# Altium project LimePSB-RPCM_1v2.PrjPcb (part 13 of 13)
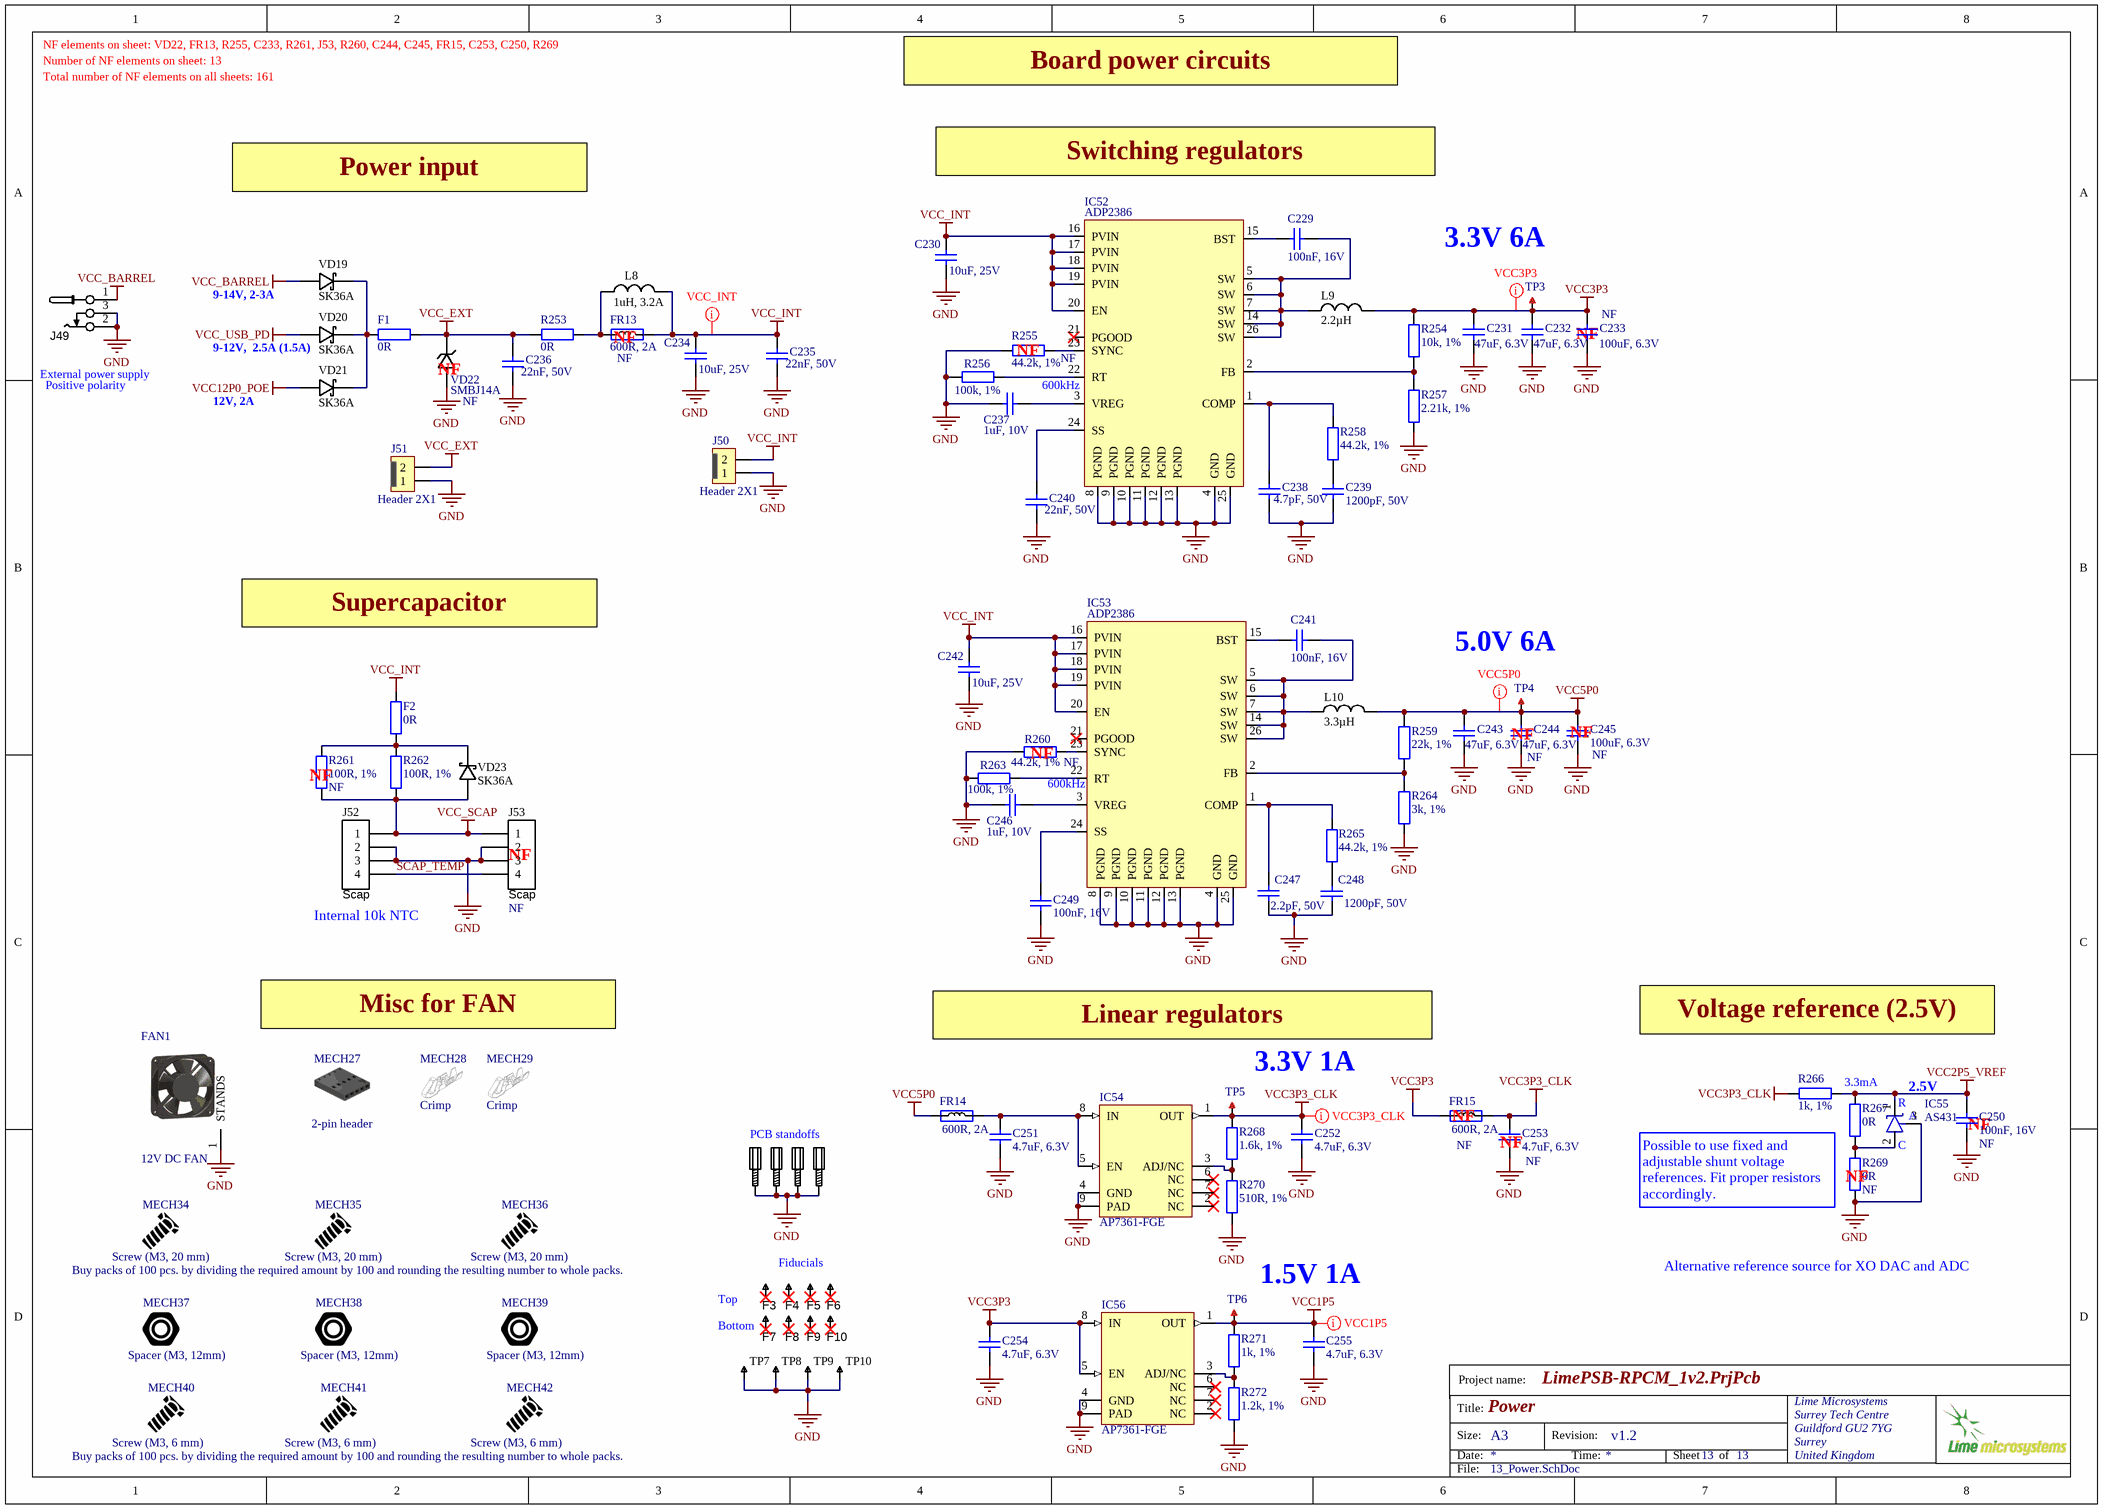
[diagram p113: 13_Power.SchDoc]

## Nets that join several sheets
GND: 05_RPi_mPCIe (82 pins), 06_Misc_1 (74 pins), 07_Misc_2 (72 pins), 08_USB_hub (61 pins), 09_USB_HDMI (90 pins), 10_Clock (80 pins), 11_RFFE (142 pins), 12_PoE_USB_PD (31 pins), 13_Power (73 pins)
USB_VBUS_IN: 08_USB_hub (6 pins), 12_PoE_USB_PD (7 pins)
VCC1P5: 05_RPi_mPCIe (J3.6 J3.28 J3.48), 13_Power (C255.2 IC56.1 R271.2 TP6.1)
VCC2P5_VREF: 07_Misc_2 (R48.1), 10_Clock (R165.2), 13_Power (C250.2 IC55.1 R266.1 R267.1)
VCC3P3: 05_RPi_mPCIe (9 pins), 06_Misc_1 (35 pins), 07_Misc_2 (35 pins), 08_USB_hub (28 pins), 09_USB_HDMI (9 pins), 10_Clock (C147.1 IC35.9), 13_Power (10 pins)
VCC3P3_CLK: 10_Clock (13 pins), 13_Power (7 pins)
VCC5P0: 05_RPi_mPCIe (8 pins), 06_Misc_1 (6 pins), 07_Misc_2 (6 pins), 08_USB_hub (8 pins), 09_USB_HDMI (11 pins), 11_RFFE (FR9.1 FR10.1), 13_Power (7 pins)
VCC12P0_POE: 07_Misc_2 (R56.1), 12_PoE_USB_PD (7 pins), 13_Power (VD21.A)
VCC_BARREL: 07_Misc_2 (R54.1), 13_Power (J49.1 VD19.A)
VCC_EXT: 07_Misc_2 (R57.1), 13_Power (5 pins)
VCC_INT: 07_Misc_2 (R58.1 R80.1), 13_Power (18 pins)
VCC_SCAP: 07_Misc_2 (R59.1), 13_Power (5 pins)
VCC_USB_PD: 07_Misc_2 (R55.1), 12_PoE_USB_PD (C222.2 IC50.5 IC50.6 IC51.11), 13_Power (VD20.A)
ADF_MUXOUT: 05_RPi_mPCIe (J1.56), 10_Clock (IC34.15 R174.1)
BUZZER: 05_RPi_mPCIe (J1.34), 06_Misc_1 (R28.1 R31.1 VT1.G)
CAM1_CLK_N: 05_RPi_mPCIe (J2.27), 06_Misc_1 (J16.8)
CAM1_CLK_P: 05_RPi_mPCIe (J2.29), 06_Misc_1 (J16.9)
CAM1_D0_N: 05_RPi_mPCIe (J2.15), 06_Misc_1 (J16.2)
CAM1_D0_P: 05_RPi_mPCIe (J2.17), 06_Misc_1 (J16.3)
CAM1_D1_N: 05_RPi_mPCIe (J2.21), 06_Misc_1 (J16.5)
CAM1_D1_P: 05_RPi_mPCIe (J2.23), 06_Misc_1 (J16.6)
CAM1_GPIO0: 05_RPi_mPCIe (J1.97), 06_Misc_1 (J16.11)
DSI1_CLK_N: 05_RPi_mPCIe (J2.87), 06_Misc_1 (J15.5)
DSI1_CLK_P: 05_RPi_mPCIe (J2.89), 06_Misc_1 (J15.6)
DSI1_D0_N: 05_RPi_mPCIe (J2.75), 06_Misc_1 (J15.8)
DSI1_D0_P: 05_RPi_mPCIe (J2.77), 06_Misc_1 (J15.9)
DSI1_D1_N: 05_RPi_mPCIe (J2.81), 06_Misc_1 (J15.2)
DSI1_D1_P: 05_RPi_mPCIe (J2.83), 06_Misc_1 (J15.3)
EN_CM5_USB3: 05_RPi_mPCIe (IC1.6), 06_Misc_1 (SW1.4), 09_USB_HDMI (6 pins)
EN_RXA_LNA: 07_Misc_2 (IC17.1), 11_RFFE (IC48.3 R194.2 R204.1)
EN_RXB_LNA: 07_Misc_2 (IC17.3), 11_RFFE (IC46.3 R192.2 R202.1)
EN_TXA_PA: 07_Misc_2 (IC17.15), 11_RFFE (IC47.3 R193.2 R203.1)
EN_TXB_PA: 07_Misc_2 (IC17.2), 11_RFFE (IC45.3 R191.2 R201.1)
ETH_LED_G: 05_RPi_mPCIe (J1.17), 06_Misc_1 (R29.2)
ETH_LED_Y: 05_RPi_mPCIe (J1.15), 06_Misc_1 (R30.2)
ETH_TRD0_N: 05_RPi_mPCIe (J1.10), 06_Misc_1 (J9.2 VD2.A)
ETH_TRD0_P: 05_RPi_mPCIe (J1.12), 06_Misc_1 (J9.1 VD1.A)
ETH_TRD1_N: 05_RPi_mPCIe (J1.6), 06_Misc_1 (J9.6 VD4.A)
ETH_TRD1_P: 05_RPi_mPCIe (J1.4), 06_Misc_1 (J9.3 VD3.A)
ETH_TRD2_N: 05_RPi_mPCIe (J1.9), 06_Misc_1 (J9.8 VD6.A)
ETH_TRD2_P: 05_RPi_mPCIe (J1.11), 06_Misc_1 (J9.7 VD5.A)
ETH_TRD3_N: 05_RPi_mPCIe (J1.5), 06_Misc_1 (J9.10 VD8.A)
ETH_TRD3_P: 05_RPi_mPCIe (J1.3), 06_Misc_1 (J9.9 VD7.A)
ETH_VC1: 06_Misc_1 (J9.11 J13.2), 12_PoE_USB_PD (BR1.4)
ETH_VC2: 06_Misc_1 (J9.12 J13.1), 12_PoE_USB_PD (BR1.3)
ETH_VC3: 06_Misc_1 (J9.13 J13.4), 12_PoE_USB_PD (BR2.4)
ETH_VC4: 06_Misc_1 (J9.14 J13.3), 12_PoE_USB_PD (BR2.3)
HDMI0_CEC: 05_RPi_mPCIe (J2.51), 09_USB_HDMI (ESD10.1 J30.13)
HDMI0_CLK_N: 05_RPi_mPCIe (J2.90), 09_USB_HDMI (ESD9.1 J30.12)
HDMI0_CLK_P: 05_RPi_mPCIe (J2.88), 09_USB_HDMI (ESD8.1 J30.10)
HDMI0_D0_N: 05_RPi_mPCIe (J2.84), 09_USB_HDMI (ESD7.1 J30.9)
HDMI0_D0_P: 05_RPi_mPCIe (J2.82), 09_USB_HDMI (ESD6.1 J30.7)
HDMI0_D1_N: 05_RPi_mPCIe (J2.78), 09_USB_HDMI (ESD5.1 J30.6)
HDMI0_D1_P: 05_RPi_mPCIe (J2.76), 09_USB_HDMI (ESD4.1 J30.4)
HDMI0_D2_N: 05_RPi_mPCIe (J2.72), 09_USB_HDMI (ESD3.1 J30.3)
HDMI0_D2_P: 05_RPi_mPCIe (J2.70), 09_USB_HDMI (ESD2.1 J30.1)
HDMI0_HPD: 05_RPi_mPCIe (J2.53), 09_USB_HDMI (ESD13.1 J30.19)
HDMI0_SCL: 05_RPi_mPCIe (J2.100), 09_USB_HDMI (ESD11.1 J30.15)
HDMI0_SDA: 05_RPi_mPCIe (J2.99), 09_USB_HDMI (ESD12.1 J30.16)
HDMI1_CEC: 05_RPi_mPCIe (J2.49), 09_USB_HDMI (ESD22.1 J31.13)
HDMI1_CLK_N: 05_RPi_mPCIe (J2.66), 09_USB_HDMI (ESD21.1 J31.12)
HDMI1_CLK_P: 05_RPi_mPCIe (J2.64), 09_USB_HDMI (ESD20.1 J31.10)
HDMI1_D0_N: 05_RPi_mPCIe (J2.60), 09_USB_HDMI (ESD19.1 J31.9)
HDMI1_D0_P: 05_RPi_mPCIe (J2.58), 09_USB_HDMI (ESD18.1 J31.7)
HDMI1_D1_N: 05_RPi_mPCIe (J2.54), 09_USB_HDMI (ESD17.1 J31.6)
HDMI1_D1_P: 05_RPi_mPCIe (J2.52), 09_USB_HDMI (ESD16.1 J31.4)
HDMI1_D2_N: 05_RPi_mPCIe (J2.48), 09_USB_HDMI (ESD15.1 J31.3)
HDMI1_D2_P: 05_RPi_mPCIe (J2.46), 09_USB_HDMI (ESD14.1 J31.1)
HDMI1_HPD: 05_RPi_mPCIe (J2.43), 09_USB_HDMI (ESD25.1 J31.19)
HDMI1_SCL: 05_RPi_mPCIe (J2.47), 09_USB_HDMI (ESD23.1 J31.15)
HDMI1_SDA: 05_RPi_mPCIe (J2.45), 09_USB_HDMI (ESD24.1 J31.16)
PCIE_COEX1: 05_RPi_mPCIe (J3.3), 10_Clock (R153.2)
PCIE_PPS_IN: 05_RPi_mPCIe (R2.2 R4.2), 10_Clock (J37.2 R153.1)
PCIE_PPS_OUT: 05_RPi_mPCIe (R3.2 R8.2), 10_Clock (J34.3 J38.1)
PCIE_UIM8: 05_RPi_mPCIe (J3.17), 07_Misc_2 (R39.2)
PCIE_UIMC4: 05_RPi_mPCIe (J3.19), 10_Clock (J39.2)
PCIE_USB_N: 05_RPi_mPCIe (J3.36), 08_USB_hub (R98.2 R102.1)
PCIE_USB_P: 05_RPi_mPCIe (J3.38), 08_USB_hub (R97.2 R99.1)
PTP_SYNC_SEL: 07_Misc_2 (IC17.6), 10_Clock (IC35.10 R183.1)
RF_SW_TDD: 07_Misc_2 (J19.2 R39.1 R40.1 R42.1), 11_RFFE (8 pins)
RPI_AIP0: 05_RPi_mPCIe (J1.96), 06_Misc_1 (J12.5)
RPI_AIP1: 05_RPi_mPCIe (J1.94), 06_Misc_1 (J12.6)
RPI_BTN1: 05_RPi_mPCIe (J1.45), 06_Misc_1 (BTN1.1 C25.1 R27.2)
RPI_BTN2: 05_RPi_mPCIe (J1.47), 06_Misc_1 (C12.1 J8.5 R13.2)
RPI_EEPROM_nWP: 05_RPi_mPCIe (J1.20), 06_Misc_1 (J12.4 R32.2)
RPI_GLOBAL_EN: 05_RPi_mPCIe (J1.99 J5.1), 06_Misc_1 (J12.14), 07_Misc_2 (R93.1)
RPI_GPIO2: 05_RPi_mPCIe (J1.58), 06_Misc_1 (J10.15)
RPI_GPIO4: 05_RPi_mPCIe (J1.54), 06_Misc_1 (J10.16)
RPI_GPIO22: 05_RPi_mPCIe (J1.46), 06_Misc_1 (J10.3)
RPI_GPIO27: 05_RPi_mPCIe (J1.48), 06_Misc_1 (J10.5)
RPI_I2C0_SCL: 05_RPi_mPCIe (J1.80 R10.2), 06_Misc_1 (J15.11 J16.13), 07_Misc_2 (9 pins), 08_USB_hub (R124.2), 12_PoE_USB_PD (R251.2)
RPI_I2C0_SDA: 05_RPi_mPCIe (J1.82 R11.2), 06_Misc_1 (J15.12 J16.14), 07_Misc_2 (9 pins), 08_USB_hub (R123.2), 12_PoE_USB_PD (R250.2)
RPI_ID_SC: 05_RPi_mPCIe (J1.35), 06_Misc_1 (J8.3 J10.18 R18.1)
RPI_ID_SD: 05_RPi_mPCIe (J1.36), 06_Misc_1 (J8.4 J10.17 R14.1)
RPI_LED_nPWR: 05_RPi_mPCIe (J1.95), 06_Misc_1 (IC3.2 R12.2 R15.2)
RPI_nEXTRST: 05_RPi_mPCIe (J1.100), 08_USB_hub (R104.2)
RPI_nRPIBOOT: 05_RPi_mPCIe (J1.93), 06_Misc_1 (J12.2 SW1.1)
RPI_PIN11: 05_RPi_mPCIe (IC1.4 J2.11), 06_Misc_1 (J12.11)
RPI_PIN16: 05_RPi_mPCIe (J1.16), 10_Clock (IC35.2 R173.2)
RPI_PIN18: 05_RPi_mPCIe (J1.18), 10_Clock (IC35.1 R171.2)
RPI_PWM0: 05_RPi_mPCIe (J1.31), 06_Misc_1 (IC7.3)
RPI_PWM1: 05_RPi_mPCIe (J1.28), 06_Misc_1 (IC7.1)
RPI_RF_SW_TDD: 05_RPi_mPCIe (J1.30), 07_Misc_2 (R40.2)
RPI_RUN_PG: 05_RPi_mPCIe (J1.92 J5.3), 06_Misc_1 (IC5.2 J12.10 R21.2)
RPI_SD_CLK: 05_RPi_mPCIe (J1.57), 06_Misc_1 (J7.5)
RPI_SD_CMD: 05_RPi_mPCIe (J1.62), 06_Misc_1 (J7.3)
RPI_SD_D0: 05_RPi_mPCIe (J1.63), 06_Misc_1 (J7.7)
RPI_SD_D1: 05_RPi_mPCIe (J1.67), 06_Misc_1 (J7.8)
RPI_SD_D2: 05_RPi_mPCIe (J1.69), 06_Misc_1 (J7.1)
RPI_SD_D3: 05_RPi_mPCIe (J1.61), 06_Misc_1 (J7.2)
RPI_SD_PWR_ON: 05_RPi_mPCIe (J1.75), 06_Misc_1 (IC6.3 R22.1)
RPI_SPI0_MISO: 05_RPi_mPCIe (J1.40), 06_Misc_1 (J10.11)
RPI_SPI0_MOSI: 05_RPi_mPCIe (J1.44), 06_Misc_1 (J10.9), 10_Clock (R180.1 R186.2)
RPI_SPI0_SCLK: 05_RPi_mPCIe (J1.38), 06_Misc_1 (J10.13), 10_Clock (R178.1 R185.2)
RPI_SPI0_SS0: 05_RPi_mPCIe (J1.39), 10_Clock (R184.2)
RPI_SPI0_SS1: 05_RPi_mPCIe (J1.37), 10_Clock (R181.1)
RPI_SPI1_MISO: 05_RPi_mPCIe (J1.26), 07_Misc_2 (IC8.12)
RPI_SPI1_MOSI: 05_RPi_mPCIe (J1.27), 07_Misc_2 (IC8.11 IC15.14)
RPI_SPI1_SCLK: 05_RPi_mPCIe (J1.25), 07_Misc_2 (IC8.13 IC15.11 IC17.11)
RPI_SPI1_SS0: 05_RPi_mPCIe (J1.49), 07_Misc_2 (IC8.10)
RPI_SPI1_SS1: 05_RPi_mPCIe (J1.50), 07_Misc_2 (IC15.12 IC17.12)
RPI_STATUS_LED_G: 06_Misc_1 (IC3.4 R15.1), 07_Misc_2 (R87.1 R94.2)
RPI_STATUS_LED_R: 05_RPi_mPCIe (J1.21), 07_Misc_2 (R89.1)
RPI_SYNC_IN: 06_Misc_1 (IC4.4 J12.8 R23.1), 10_Clock (J38.2)
RPI_SYNC_IN_LS: 06_Misc_1 (IC4.3 R23.2), 10_Clock (IC35.4 IC35.7 R173.1)
RPI_SYNC_OUT: 06_Misc_1 (IC2.4 J12.9 R16.1), 10_Clock (J34.5 J36.1 J37.1)
RPI_SYNC_OUT_LS: 06_Misc_1 (IC2.3 R16.2), 10_Clock (IC35.5 R171.1)
RPI_TVDAC: 05_RPi_mPCIe (IC1.3), 06_Misc_1 (J14.1 J17.4)
RPI_UART0_RX: 05_RPi_mPCIe (J1.51), 06_Misc_1 (J10.10 J11.3)
RPI_UART0_TX: 05_RPi_mPCIe (J1.55), 06_Misc_1 (J10.8 J11.2)
RPI_USB3_D0_N: 05_RPi_mPCIe (J2.36), 09_USB_HDMI (IC26.7)
RPI_USB3_D0_P: 05_RPi_mPCIe (J2.34), 09_USB_HDMI (IC26.6)
RPI_USB3_D1_N: 05_RPi_mPCIe (J2.65), 09_USB_HDMI (IC27.7)
RPI_USB3_D1_P: 05_RPi_mPCIe (J2.63), 09_USB_HDMI (IC27.6)
RPI_USB3_RX0_N: 05_RPi_mPCIe (J2.28), 09_USB_HDMI (IC29.4)
RPI_USB3_RX0_P: 05_RPi_mPCIe (J2.30), 09_USB_HDMI (IC29.5)
RPI_USB3_RX1_N: 05_RPi_mPCIe (J2.57), 09_USB_HDMI (IC30.4)
RPI_USB3_RX1_P: 05_RPi_mPCIe (J2.59), 09_USB_HDMI (IC30.5)
RPI_USB3_TX0_N: 05_RPi_mPCIe (J2.40), 09_USB_HDMI (IC29.1)
RPI_USB3_TX0_P: 05_RPi_mPCIe (J2.42), 09_USB_HDMI (IC29.2)
RPI_USB3_TX1_N: 05_RPi_mPCIe (J2.69), 09_USB_HDMI (IC30.1)
RPI_USB3_TX1_P: 05_RPi_mPCIe (J2.71), 09_USB_HDMI (IC30.2)
RPI_USB_D_N: 05_RPi_mPCIe (J2.3), 08_USB_hub (IC21.2 R122.2)
RPI_USB_D_P: 05_RPi_mPCIe (J2.5), 08_USB_hub (IC21.1 R121.2)
RPI_USB_OTG_ID: 05_RPi_mPCIe (J2.1), 08_USB_hub (R108.1 R115.2)
RPI_VBAT: 05_RPi_mPCIe (J1.76), 07_Misc_2 (R78.1)
RPI_VBUS_EN: 05_RPi_mPCIe (IC1.1), 09_USB_HDMI (R137.2)
SCAP_TEMP: 07_Misc_2 (C36.1 IC8.7 R46.2 R50.1), 13_Power (J52.4 J53.4)
USB_C_RPI1: 06_Misc_1 (SW1.2), 08_USB_hub (J26.1 R114.1 R119.1)
USB_C_RPI2: 06_Misc_1 (SW1.7), 08_USB_hub (J26.2 R109.1 R110.1 R114.2)
USB_CC1: 08_USB_hub (J25.A5), 12_PoE_USB_PD (C228.1 IC51.15)
USB_CC2: 08_USB_hub (J25.B5), 12_PoE_USB_PD (C227.1 IC51.14)
USB_HUB_D2_N: 08_USB_hub (IC20.3), 09_USB_HDMI (IC26.5)
USB_HUB_D2_P: 08_USB_hub (IC20.4), 09_USB_HDMI (IC26.4)
USB_HUB_D3_N: 08_USB_hub (IC20.6), 09_USB_HDMI (IC27.5)
USB_HUB_D3_P: 08_USB_hub (IC20.7), 09_USB_HDMI (IC27.4)
USB_HUB_OCS23: 08_USB_hub (IC20.22 IC20.27), 09_USB_HDMI (R139.2)
USB_HUB_PRTPWR_23: 08_USB_hub (IC20.26), 09_USB_HDMI (R135.2)
USB_PD_I: 06_Misc_1 (SW1.3), 12_PoE_USB_PD (J48.2 R241.1 R245.1)